# Altium schematic sheet k26_baseboard_power_supply.SchDoc: k26 Baseboard Power Supply (part 3 of 3)
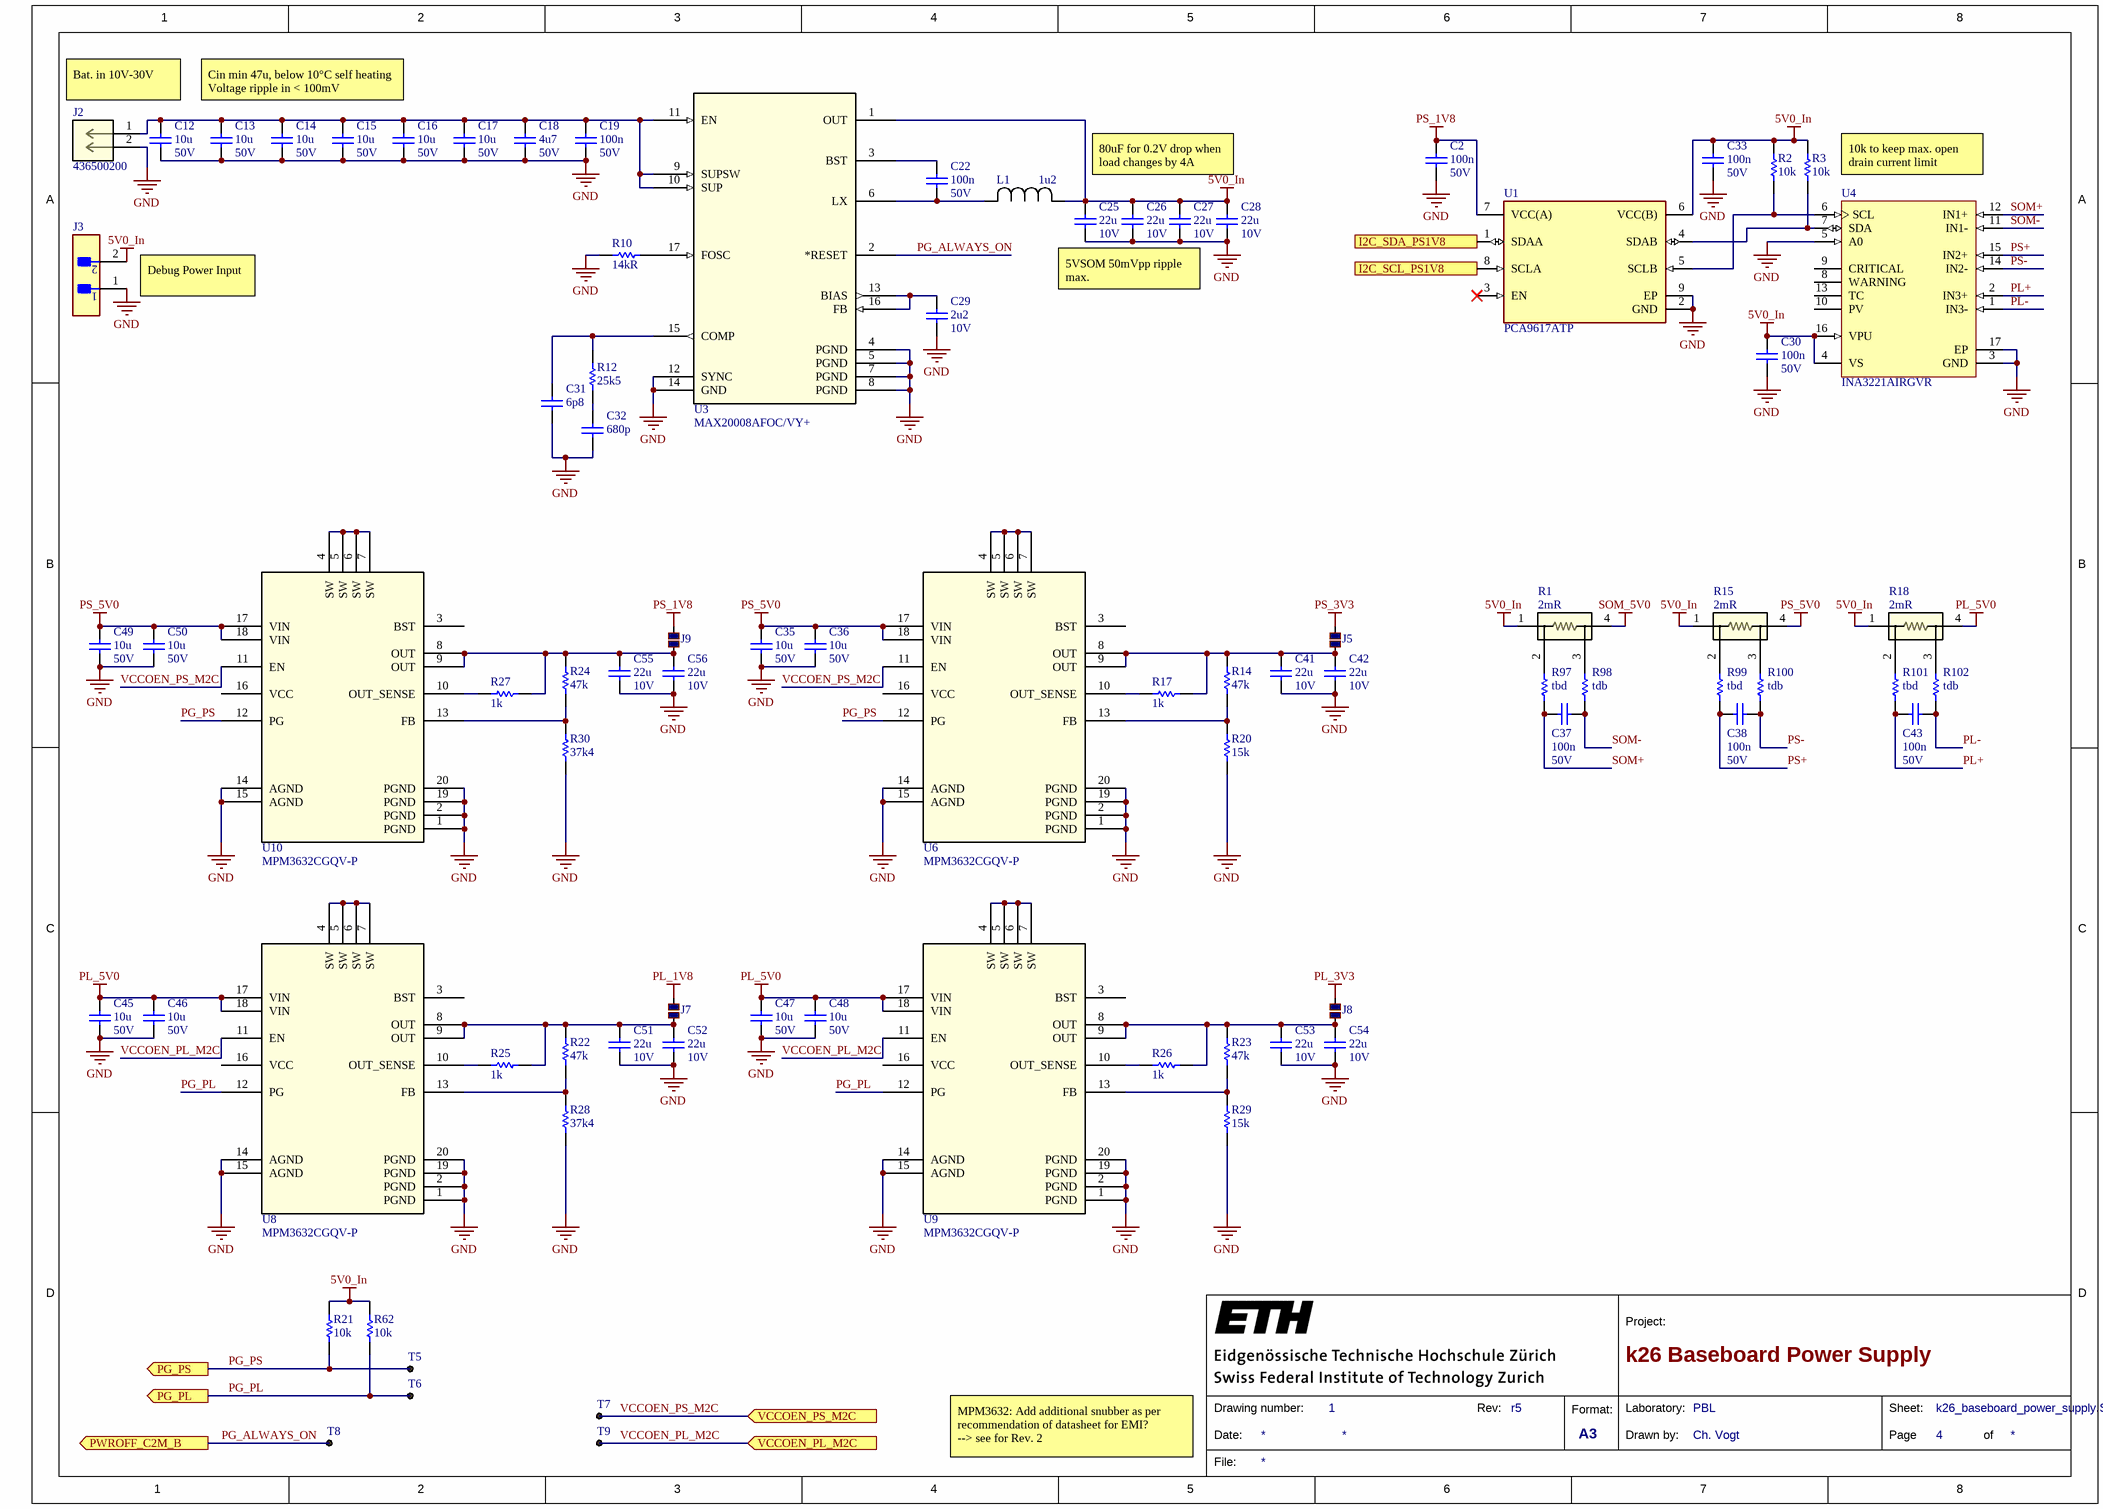
[diagram p2: k26_baseboard_power_supply.SchDoc]

## Library data of the parts (continued)
  R62: ComponentLink2URL: https://datasheet.ciiva.com/6201/426256-6201373.pdf?src-supplier=Farnell; ComponentLink2Description: https://datasheet.ciiva.com/6201/426256-6201373.pdf?src-supplier=Farnell; ComponentLink3URL: https://datasheet.ciiva.com/46377/426256-46377550.pdf?src-supplier=Element14; ComponentLink3Description: https://datasheet.ciiva.com/46377/426256-46377550.pdf?src-supplier=Element14; ComponentLink4URL: https://datasheet.ciiva.com/22749/1678782-22749610.pdf?src-supplier=Element14; ComponentLink4Description: https://datasheet.ciiva.com/22749/1678782-22749610.pdf?src-supplier=Element14; ComponentLink5URL: https://datasheet.ciiva.com/28695/1678782-28695781.pdf?src-supplier=Element14; ComponentLink5Description: https://datasheet.ciiva.com/28695/1678782-28695781.pdf?src-supplier=Element14; ComponentLink6URL: https://datasheet.ciiva.com/16766/70260748-16766015.pdf?src-supplier=Allied+Electronics; ComponentLink6Description: https://datasheet.ciiva.com/16766/70260748-16766015.pdf?src-supplier=Allied+Electronics; ComponentLink7URL: https://datasheet.ciiva.com/16765/70260748-16765054.pdf?src-supplier=Allied+Electronics; ComponentLink7Description: https://datasheet.ciiva.com/16765/70260748-16765054.pdf?src-supplier=Allied+Electronics; ComponentLink8URL: https://datasheet.ciiva.com/9181/aoa0000ce2-9181461.pdf?src-supplier=Avnet; ComponentLink8Description: https://datasheet.ciiva.com/9181/aoa0000ce2-9181461.pdf?src-supplier=Avnet; ComponentLink9URL: https://datasheet.ciiva.com/16508/aoa0000ce2-16508382.pdf?src-supplier=Future+Electronics; ComponentLink9Description: https://datasheet.ciiva.com/16508/aoa0000ce2-16508382.pdf?src-supplier=Future+Electronics
R28 R30 = res0402: Fixed Resistor, Metal Glaze/thick Film, 0.1W, 37400ohm, 50V, 1% +/-Tol, 100ppm/Cel, Surface Mount, 0402; Manufacturer: Panasonic; Manufacturer Part Number: ERJ-2RKF3742X; Power: 100mW; Value: 37.4kR; Temperature Coefficient: 100ppm/°C; Rated Temperature: 70°C; Package Height: 0.35mm; Package Length: 1mm; Package Width: 0.5mm; Reference Standard: AEC-Q200; Supplier: Rs; Supplier Part Number: 1065251; RoHS: Yes; Category: Chip SMD Resistors; Stock: 180000; Pricing: 10000=0.00500 (CHF); Mounting Technology: Surface Mount; Pins: 2; Case/Package: 0402; Terminal Finish: Nickel; Package Shape: Rectangular; Min Operating Temperature: -55°C; Max Operating Temperature: 155°C; Tolerance: 1%; Resistor Type: FIXED RESISTOR; Packaging: Tape and Reel; Technology: METAL GLAZE/THICK FILM; Working Voltage: 50V; JESD-609 Code: e3; Construction: Rectangular; Package Style: SMTMeter; Termination: Wraparound; Reach SVHC Compliant: Yes; RoHS Compliant: Yes; ComponentLink1URL: https://datasheet.ciiva.com:443/pdfs/VipMasterIC/IC/PANA/PANA-S-A0009889626/PANA-S-A0009889626-1.pdf?src-supplier=IHS+Markit; ComponentLink1Description: https://datasheet.ciiva.com:443/pdfs/VipMasterIC/IC/PANA/PANA-S-A0009889626/PANA-S-A0009889626-1.pdf?src-supplier=IHS+Markit
  R28: ComponentLink2URL: https://datasheet.ciiva.com/7870/aoa0000ce2-7870815.pdf?src-supplier=Element14; ComponentLink2Description: https://datasheet.ciiva.com/7870/aoa0000ce2-7870815.pdf?src-supplier=Element14; ComponentLink3URL: https://datasheet.ciiva.com/43467/1678782-43467445.pdf?src-supplier=Farnell; ComponentLink3Description: https://datasheet.ciiva.com/43467/1678782-43467445.pdf?src-supplier=Farnell; ComponentLink4URL: https://datasheet.ciiva.com/46372/1678782-46372890.pdf?src-supplier=Element14; ComponentLink4Description: https://datasheet.ciiva.com/46372/1678782-46372890.pdf?src-supplier=Element14; ComponentLink5URL: https://datasheet.ciiva.com/22668/1678782-22668136.pdf?src-supplier=Element14; ComponentLink5Description: https://datasheet.ciiva.com/22668/1678782-22668136.pdf?src-supplier=Element14; ComponentLink6URL: https://datasheet.ciiva.com/28592/1694929-28592229.pdf?src-supplier=Element14; ComponentLink6Description: https://datasheet.ciiva.com/28592/1694929-28592229.pdf?src-supplier=Element14; ComponentLink7URL: https://datasheet.ciiva.com/46372/1678782-46372889.pdf?src-supplier=Element14; ComponentLink7Description: https://datasheet.ciiva.com/46372/1678782-46372889.pdf?src-supplier=Element14; ComponentLink8URL: https://datasheet.ciiva.com/16776/70260748-16776717.pdf?src-supplier=Allied+Electronics; ComponentLink8Description: https://datasheet.ciiva.com/16776/70260748-16776717.pdf?src-supplier=Allied+Electronics; ComponentLink9URL: https://datasheet.ciiva.com/9190/aoa0000ce2-9190119.pdf?src-supplier=Avnet; ComponentLink9Description: https://datasheet.ciiva.com/9190/aoa0000ce2-9190119.pdf?src-supplier=Avnet
  R30: ComponentLink2URL: https://datasheet.ciiva.com/6201/426256-6201373.pdf?src-supplier=Farnell; ComponentLink2Description: https://datasheet.ciiva.com/6201/426256-6201373.pdf?src-supplier=Farnell; ComponentLink3URL: https://datasheet.ciiva.com/46377/426256-46377550.pdf?src-supplier=Element14; ComponentLink3Description: https://datasheet.ciiva.com/46377/426256-46377550.pdf?src-supplier=Element14; ComponentLink4URL: https://datasheet.ciiva.com/22749/1678782-22749610.pdf?src-supplier=Element14; ComponentLink4Description: https://datasheet.ciiva.com/22749/1678782-22749610.pdf?src-supplier=Element14; ComponentLink5URL: https://datasheet.ciiva.com/28695/1678782-28695781.pdf?src-supplier=Element14; ComponentLink5Description: https://datasheet.ciiva.com/28695/1678782-28695781.pdf?src-supplier=Element14; ComponentLink6URL: https://datasheet.ciiva.com/16766/70260748-16766015.pdf?src-supplier=Allied+Electronics; ComponentLink6Description: https://datasheet.ciiva.com/16766/70260748-16766015.pdf?src-supplier=Allied+Electronics; ComponentLink7URL: https://datasheet.ciiva.com/16765/70260748-16765054.pdf?src-supplier=Allied+Electronics; ComponentLink7Description: https://datasheet.ciiva.com/16765/70260748-16765054.pdf?src-supplier=Allied+Electronics; ComponentLink8URL: https://datasheet.ciiva.com/9181/aoa0000ce2-9181461.pdf?src-supplier=Avnet; ComponentLink8Description: https://datasheet.ciiva.com/9181/aoa0000ce2-9181461.pdf?src-supplier=Avnet; ComponentLink9URL: https://datasheet.ciiva.com/16508/aoa0000ce2-16508382.pdf?src-supplier=Future+Electronics; ComponentLink9Description: https://datasheet.ciiva.com/16508/aoa0000ce2-16508382.pdf?src-supplier=Future+Electronics; ComponentLink10URL: https://datasheet.ciiva.com/7870/aoa0000ce2-7870815.pdf?src-supplier=Element14; ComponentLink10Description: https://datasheet.ciiva.com/7870/aoa0000ce2-7870815.pdf?src-supplier=Element14; ComponentLink11URL: https://datasheet.ciiva.com/43467/1678782-43467445.pdf?src-supplier=Farnell; ComponentLink11Description: https://datasheet.ciiva.com/43467/1678782-43467445.pdf?src-supplier=Farnell; ComponentLink12URL: https://datasheet.ciiva.com/46372/1678782-46372890.pdf?src-supplier=Element14; ComponentLink12Description: https://datasheet.ciiva.com/46372/1678782-46372890.pdf?src-supplier=Element14; ComponentLink13URL: https://datasheet.ciiva.com/22668/1678782-22668136.pdf?src-supplier=Element14; ComponentLink13Description: https://datasheet.ciiva.com/22668/1678782-22668136.pdf?src-supplier=Element14; ComponentLink14URL: https://datasheet.ciiva.com/28592/1694929-28592229.pdf?src-supplier=Element14; ComponentLink14Description: https://datasheet.ciiva.com/28592/1694929-28592229.pdf?src-supplier=Element14; ComponentLink15URL: https://datasheet.ciiva.com/46372/1678782-46372889.pdf?src-supplier=Element14; ComponentLink15Description: https://datasheet.ciiva.com/46372/1678782-46372889.pdf?src-supplier=Element14; ComponentLink16URL: https://datasheet.ciiva.com/16776/70260748-16776717.pdf?src-supplier=Allied+Electronics; ComponentLink16Description: https://datasheet.ciiva.com/16776/70260748-16776717.pdf?src-supplier=Allied+Electronics; ComponentLink17URL: https://datasheet.ciiva.com/9190/aoa0000ce2-9190119.pdf?src-supplier=Avnet; ComponentLink17Description: https://datasheet.ciiva.com/9190/aoa0000ce2-9190119.pdf?src-supplier=Avnet
T5-T9 = CMP-01283-1: 1mm SMT Test Pad; Mounting Technology: SMT
U1 = CMP-10125-000014-1: IC REDRIVER I2C 1CH 1MHZ 8HWSON
U3 = MAX20008AFOC/VY+: No Description Available; Mfr_Name: Maxim Integrated Products; Copyright: Copyright (C) 2022 Ultra Librarian. All rights reserved.; Manufacturer_Part_Number: MAX20008AFOC/VY+; Digi-Key_Part_Number_1: MAX20008AFOC/VY+-ND; RefDes: RefDes; Type: DEV
U4 = CMP-0704-00001-2: Triple Channel Shunt and Bus Voltage Monitor, 120 dB, 2.7 to 5.5 V, -40 to 125 degC, 16-Pin VQFN (RGV), Green (RoHS & no Sb/Br), Tape and Reel; Manufacturer: Texas Instruments; Rating: Catalog; Quiescent Current (Typ): 350 uA; Gain Error (max): 0.25%; CMR (Typ): 120 dB; Offset Voltage (max): +/- 80 uV; Gain: 1 V/V; Voltage Input Range (Bus): 0 to 26 V; ComponentLink2Description: Datasheet; PackageDescription: 16-Pin Quad Flat No-lead Package, Body 4 x 4 mm, Pitch 0.65 mm; ComponentLink3URL: http://www.ti.com/lit/ds/symlink/ina3221.pdf; PartNumber: INA3221AIRGVR; Operating Supply Range: 2.7 to 5.5 V; DatasheetVersion: SBOS576A; Temperature Range: -40 to 125 degC; ComponentLink1Description: Manufacturer URL; ComponentLink1URL: http://www.ti.com/; RoHS: TRUE; ComponentLink3Description: Package Specification; Packing: Tape and Reel; Mounting Technology: Surface Mount; ComponentLink2URL: http://www.ti.com/lit/ds/symlink/ina3221.pdf; PackageVersion: SBOS576A; PackageReference: RGV0016A
U6 U8-U10 = MPM3632CGQV-P: No Description Available; Mfr_Name: Monolithic Power Systems; Copyright: Copyright (C) 2022 Ultra Librarian. All rights reserved.; Manufacturer_Part_Number: MPM3632CGQV-P; RefDes: RefDes; Type: DEV